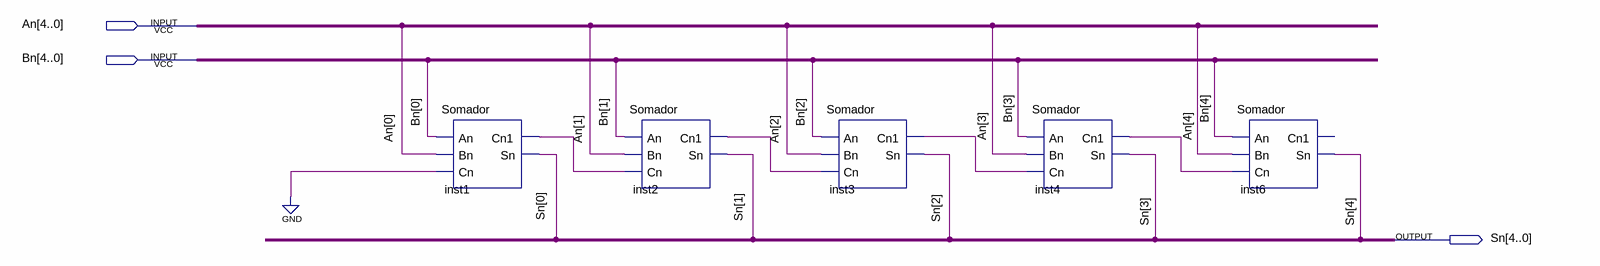
[diagram p0: schematic sheet]
// Quartus schematic SomadorCompleto4Bits.bdf as structural Verilog: 5 symbols, 3 pins
module SomadorCompleto4Bits (
  input  [4:0] An,
  input  [4:0] Bn,
  output [4:0] Sn
);

  wire inst1_cn1, inst2_cn1, inst3_cn1, inst4_cn1;

  Somador inst1 (.An(Bn[0]), .Bn(An[0]), .Cn(1'b0), .Cn1(inst1_cn1), .Sn(Sn[0]));
  Somador inst2 (.An(Bn[1]), .Bn(An[1]), .Cn(inst1_cn1), .Cn1(inst2_cn1), .Sn(Sn[1]));
  Somador inst3 (.An(Bn[2]), .Bn(An[2]), .Cn(inst2_cn1), .Cn1(inst3_cn1), .Sn(Sn[2]));
  Somador inst4 (.An(Bn[3]), .Bn(An[3]), .Cn(inst3_cn1), .Cn1(inst4_cn1), .Sn(Sn[3]));
  Somador inst6 (.An(Bn[4]), .Bn(An[4]), .Cn(inst4_cn1), .Sn(Sn[4]));  // open: Cn1
endmodule
